# EAGLE design Protoboard MX3-11-8 (EAGLE 7.7.0)

## Sheet 1 of 2
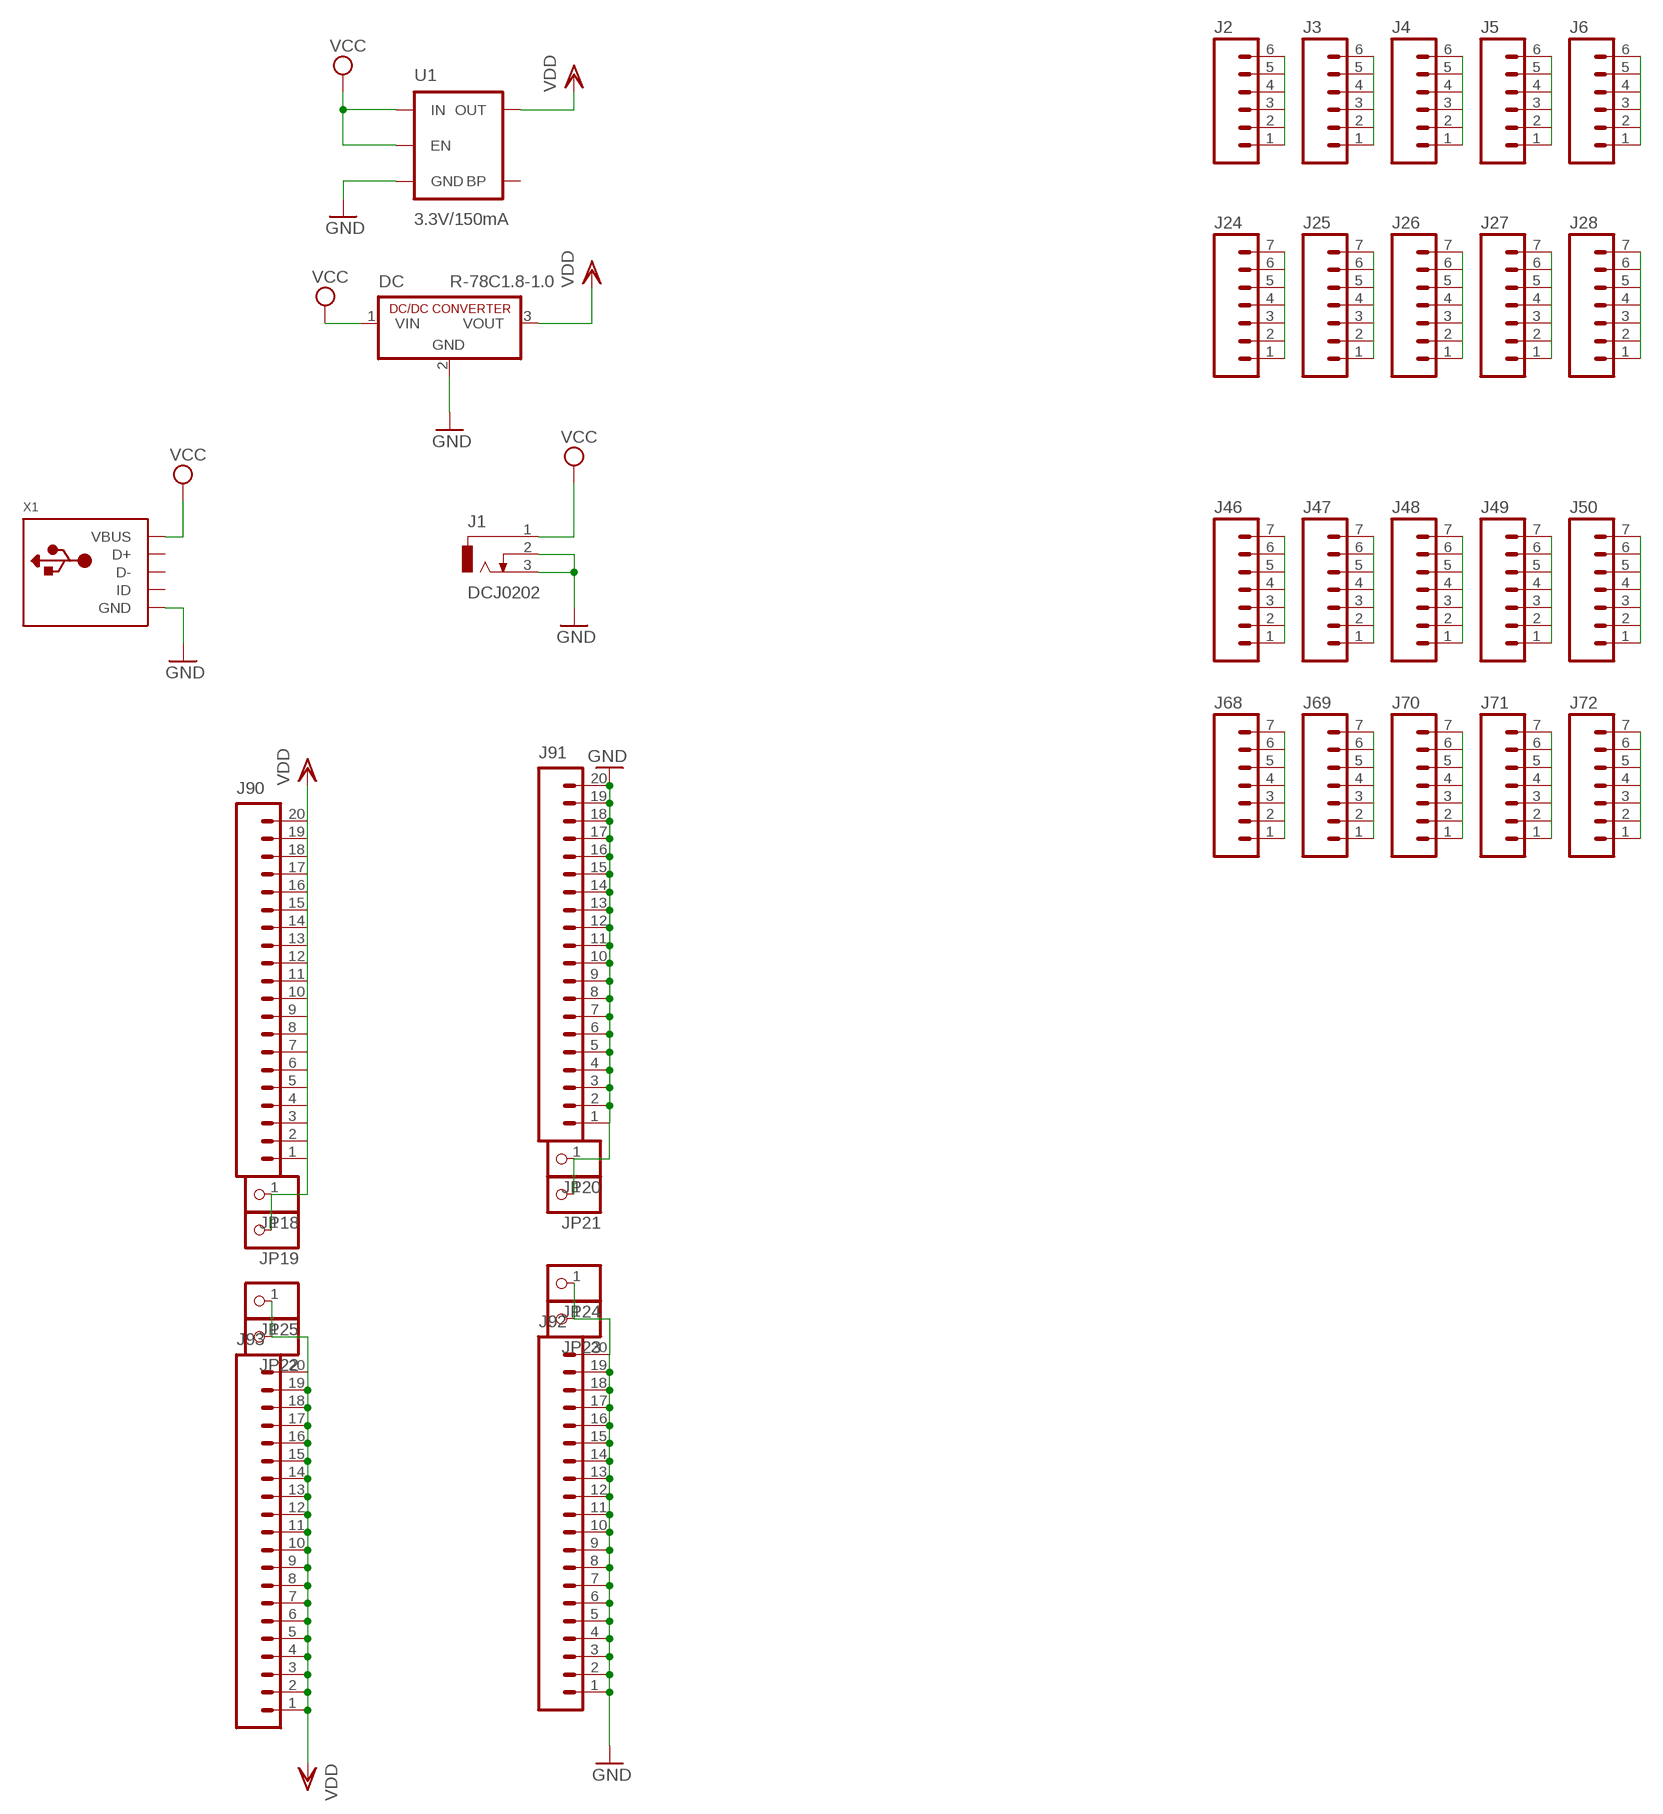
[diagram p0: schematic, sheet 1, part 1 of 2]
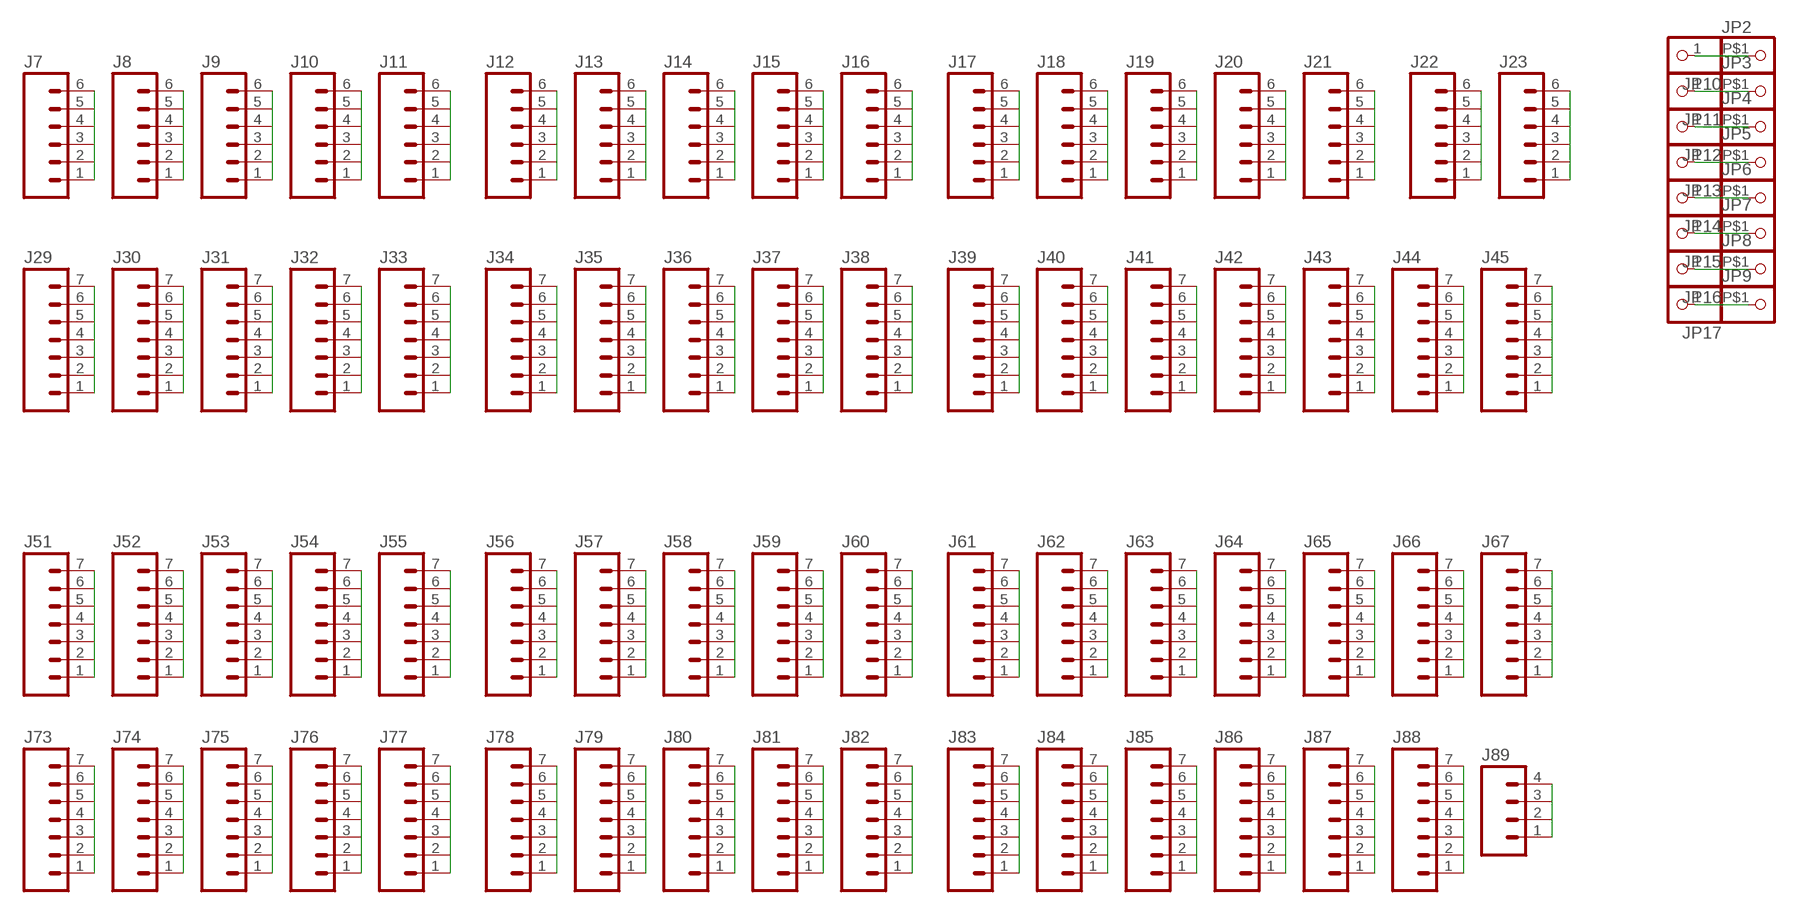
[diagram p1: schematic, sheet 1, part 2 of 2]

### Parts
DC  R-78C1.8-1.0  [SIP3]
J1  DCJ0202  [DCJ0202]
J2  M06NO_SILK_FEMALE_PTH  [1X06_NO_SILK]
J3  M06NO_SILK_FEMALE_PTH  [1X06_NO_SILK]
J4  M06NO_SILK_FEMALE_PTH  [1X06_NO_SILK]
J5  M06NO_SILK_FEMALE_PTH  [1X06_NO_SILK]
J6  M06NO_SILK_FEMALE_PTH  [1X06_NO_SILK]
J7  M06NO_SILK_FEMALE_PTH  [1X06_NO_SILK]
J8  M06NO_SILK_FEMALE_PTH  [1X06_NO_SILK]
J9  M06NO_SILK_FEMALE_PTH  [1X06_NO_SILK]
J10  M06NO_SILK_FEMALE_PTH  [1X06_NO_SILK]
J11  M06NO_SILK_FEMALE_PTH  [1X06_NO_SILK]
J12  M06NO_SILK_FEMALE_PTH  [1X06_NO_SILK]
J13  M06NO_SILK_FEMALE_PTH  [1X06_NO_SILK]
J14  M06NO_SILK_FEMALE_PTH  [1X06_NO_SILK]
J15  M06NO_SILK_FEMALE_PTH  [1X06_NO_SILK]
J16  M06NO_SILK_FEMALE_PTH  [1X06_NO_SILK]
J17  M06NO_SILK_FEMALE_PTH  [1X06_NO_SILK]
J18  M06NO_SILK_FEMALE_PTH  [1X06_NO_SILK]
J19  M06NO_SILK_FEMALE_PTH  [1X06_NO_SILK]
J20  M06NO_SILK_FEMALE_PTH  [1X06_NO_SILK]
J21  M06NO_SILK_FEMALE_PTH  [1X06_NO_SILK]
J22  M06NO_SILK_FEMALE_PTH  [1X06_NO_SILK]
J23  M06NO_SILK_FEMALE_PTH  [1X06_NO_SILK]
J24  M07NO_SILK  [1X07_NO_SILK]
J25  M07NO_SILK  [1X07_NO_SILK]
J26  M07NO_SILK  [1X07_NO_SILK]
J27  M07NO_SILK  [1X07_NO_SILK]
J28  M07NO_SILK  [1X07_NO_SILK]
J29  M07NO_SILK  [1X07_NO_SILK]
J30  M07NO_SILK  [1X07_NO_SILK]
J31  M07NO_SILK  [1X07_NO_SILK]
J32  M07NO_SILK  [1X07_NO_SILK]
J33  M07NO_SILK  [1X07_NO_SILK]
J34  M07NO_SILK  [1X07_NO_SILK]
J35  M07NO_SILK  [1X07_NO_SILK]
J36  M07NO_SILK  [1X07_NO_SILK]
J37  M07NO_SILK  [1X07_NO_SILK]
J38  M07NO_SILK  [1X07_NO_SILK]
J39  M07NO_SILK  [1X07_NO_SILK]
J40  M07NO_SILK  [1X07_NO_SILK]
J41  M07NO_SILK  [1X07_NO_SILK]
J42  M07NO_SILK  [1X07_NO_SILK]
J43  M07NO_SILK  [1X07_NO_SILK]
J44  M07NO_SILK  [1X07_NO_SILK]
J45  M07NO_SILK  [1X07_NO_SILK]
J46  M07NO_SILK  [1X07_NO_SILK]
J47  M07NO_SILK  [1X07_NO_SILK]
J48  M07NO_SILK  [1X07_NO_SILK]
J49  M07NO_SILK  [1X07_NO_SILK]
J50  M07NO_SILK  [1X07_NO_SILK]
J51  M07NO_SILK  [1X07_NO_SILK]
J52  M07NO_SILK  [1X07_NO_SILK]
J53  M07NO_SILK  [1X07_NO_SILK]
J54  M07NO_SILK  [1X07_NO_SILK]
J55  M07NO_SILK  [1X07_NO_SILK]
J56  M07NO_SILK  [1X07_NO_SILK]
J57  M07NO_SILK  [1X07_NO_SILK]
J58  M07NO_SILK  [1X07_NO_SILK]
J59  M07NO_SILK  [1X07_NO_SILK]
J60  M07NO_SILK  [1X07_NO_SILK]
J61  M07NO_SILK  [1X07_NO_SILK]
J62  M07NO_SILK  [1X07_NO_SILK]
J63  M07NO_SILK  [1X07_NO_SILK]
J64  M07NO_SILK  [1X07_NO_SILK]
J65  M07NO_SILK  [1X07_NO_SILK]
J66  M07NO_SILK  [1X07_NO_SILK]
J67  M07NO_SILK  [1X07_NO_SILK]
J68  M07NO_SILK  [1X07_NO_SILK]
J69  M07NO_SILK  [1X07_NO_SILK]
J70  M07NO_SILK  [1X07_NO_SILK]
J71  M07NO_SILK  [1X07_NO_SILK]
J72  M07NO_SILK  [1X07_NO_SILK]
J73  M07NO_SILK  [1X07_NO_SILK]
J74  M07NO_SILK  [1X07_NO_SILK]
J75  M07NO_SILK  [1X07_NO_SILK]
J76  M07NO_SILK  [1X07_NO_SILK]
J77  M07NO_SILK  [1X07_NO_SILK]
J78  M07NO_SILK  [1X07_NO_SILK]
J79  M07NO_SILK  [1X07_NO_SILK]
J80  M07NO_SILK  [1X07_NO_SILK]
J81  M07NO_SILK  [1X07_NO_SILK]
J82  M07NO_SILK  [1X07_NO_SILK]
J83  M07NO_SILK  [1X07_NO_SILK]
J84  M07NO_SILK  [1X07_NO_SILK]
J85  M07NO_SILK  [1X07_NO_SILK]
J86  M07NO_SILK  [1X07_NO_SILK]
J87  M07NO_SILK  [1X07_NO_SILK]
J88  M07NO_SILK  [1X07_NO_SILK]
J89  M04NO_SILK_ALL_ROUND  [1X04_NO_SILK_ALL_ROUND]
J90  M20NO_SILK_KIT  [1X20_NO_SILK_KIT]
J91  M20NO_SILK_KIT  [1X20_NO_SILK_KIT]
J92  M20NO_SILK_KIT  [1X20_NO_SILK_KIT]
J93  M20NO_SILK_KIT  [1X20_NO_SILK_KIT]
JP2  PINHD-1X1-BIGPOGO  [1X1-BIGPOGO]
JP3  PINHD-1X1-BIGPOGO  [1X1-BIGPOGO]
JP4  PINHD-1X1-BIGPOGO  [1X1-BIGPOGO]
JP5  PINHD-1X1-BIGPOGO  [1X1-BIGPOGO]
JP6  PINHD-1X1-BIGPOGO  [1X1-BIGPOGO]
JP7  PINHD-1X1-BIGPOGO  [1X1-BIGPOGO]
JP8  PINHD-1X1-BIGPOGO  [1X1-BIGPOGO]
JP9  PINHD-1X1-BIGPOGO  [1X1-BIGPOGO]
JP10  PINHD-1X1CB  [1X01-CLEANBIG]
JP11  PINHD-1X1CB  [1X01-CLEANBIG]
JP12  PINHD-1X1CB  [1X01-CLEANBIG]
JP13  PINHD-1X1CB  [1X01-CLEANBIG]
JP14  PINHD-1X1CB  [1X01-CLEANBIG]
JP15  PINHD-1X1CB  [1X01-CLEANBIG]
JP16  PINHD-1X1CB  [1X01-CLEANBIG]
JP17  PINHD-1X1CB  [1X01-CLEANBIG]
JP18  PINHD-1X1CB  [1X01-CLEANBIG]
JP19  PINHD-1X1CB  [1X01-CLEANBIG]
JP20  PINHD-1X1CB  [1X01-CLEANBIG]
JP21  PINHD-1X1CB  [1X01-CLEANBIG]
JP22  PINHD-1X1CB  [1X01-CLEANBIG]
JP23  PINHD-1X1CB  [1X01-CLEANBIG]
JP24  PINHD-1X1CB  [1X01-CLEANBIG]
JP25  PINHD-1X1CB  [1X01-CLEANBIG]
U1  3.3V/150mA  V_REG_MIC52053.3V  [SOT23-5]
X1  USBMICRO_20329  [4UCONN_20329]

### Nets
GND: DC.2(GND) J1.2 J1.3 J91.1 J91.2 J91.3 J91.4 J91.5 J91.6 J91.7 J91.8 J91.9 J91.10 J91.11 J91.12 J91.13 J91.14 J91.15 J91.16 J91.17 J91.18 J91.19 J91.20 J92.1 J92.2 J92.3 J92.4 J92.5 J92.6 J92.7 J92.8 J92.9 J92.10 J92.11 J92.12 J92.13 J92.14 J92.15 J92.16 J92.17 J92.18 J92.19 J92.20 JP20.1 JP21.1 JP23.1 JP24.1 U1.2(GND) X1.BASE@1(GND) X1.BASE@2(GND) X1.GND X1.SPRT@1(GND) X1.SPRT@2(GND) X1.SPRT@3(GND) X1.SPRT@4(GND)
N$1: J2.1 J2.2 J2.3 J2.4 J2.5 J2.6
N$2: J3.1 J3.2 J3.3 J3.4 J3.5 J3.6
N$3: J4.1 J4.2 J4.3 J4.4 J4.5 J4.6
N$4: J5.1 J5.2 J5.3 J5.4 J5.5 J5.6
N$5: J6.1 J6.2 J6.3 J6.4 J6.5 J6.6
N$6: J7.1 J7.2 J7.3 J7.4 J7.5 J7.6
N$7: J8.1 J8.2 J8.3 J8.4 J8.5 J8.6
N$8: J9.1 J9.2 J9.3 J9.4 J9.5 J9.6
N$9: J10.1 J10.2 J10.3 J10.4 J10.5 J10.6
N$10: J11.1 J11.2 J11.3 J11.4 J11.5 J11.6
N$11: J12.1 J12.2 J12.3 J12.4 J12.5 J12.6
N$12: J13.1 J13.2 J13.3 J13.4 J13.5 J13.6
N$13: J14.1 J14.2 J14.3 J14.4 J14.5 J14.6
N$14: J15.1 J15.2 J15.3 J15.4 J15.5 J15.6
N$15: J16.1 J16.2 J16.3 J16.4 J16.5 J16.6
N$16: J17.1 J17.2 J17.3 J17.4 J17.5 J17.6
N$17: J18.1 J18.2 J18.3 J18.4 J18.5 J18.6
N$18: J19.1 J19.2 J19.3 J19.4 J19.5 J19.6
N$19: J20.1 J20.2 J20.3 J20.4 J20.5 J20.6
N$20: J21.1 J21.2 J21.3 J21.4 J21.5 J21.6
N$21: J22.1 J22.2 J22.3 J22.4 J22.5 J22.6
N$22: J23.1 J23.2 J23.3 J23.4 J23.5 J23.6
N$23: J24.1 J24.2 J24.3 J24.4 J24.5 J24.6 J24.7
N$24: J25.1 J25.2 J25.3 J25.4 J25.5 J25.6 J25.7
N$25: J26.1 J26.2 J26.3 J26.4 J26.5 J26.6 J26.7
N$26: J27.1 J27.2 J27.3 J27.4 J27.5 J27.6 J27.7
N$27: J28.1 J28.2 J28.3 J28.4 J28.5 J28.6 J28.7
N$28: J29.1 J29.2 J29.3 J29.4 J29.5 J29.6 J29.7
N$29: J30.1 J30.2 J30.3 J30.4 J30.5 J30.6 J30.7
N$30: J31.1 J31.2 J31.3 J31.4 J31.5 J31.6 J31.7
N$31: J32.1 J32.2 J32.3 J32.4 J32.5 J32.6 J32.7
N$32: J33.1 J33.2 J33.3 J33.4 J33.5 J33.6 J33.7
N$33: J34.1 J34.2 J34.3 J34.4 J34.5 J34.6 J34.7
N$34: J35.1 J35.2 J35.3 J35.4 J35.5 J35.6 J35.7
N$35: J36.1 J36.2 J36.3 J36.4 J36.5 J36.6 J36.7
N$36: J37.1 J37.2 J37.3 J37.4 J37.5 J37.6 J37.7
N$37: J38.1 J38.2 J38.3 J38.4 J38.5 J38.6 J38.7
N$38: J39.1 J39.2 J39.3 J39.4 J39.5 J39.6 J39.7
N$39: J40.1 J40.2 J40.3 J40.4 J40.5 J40.6 J40.7
N$40: J41.1 J41.2 J41.3 J41.4 J41.5 J41.6 J41.7
N$41: J42.1 J42.2 J42.3 J42.4 J42.5 J42.6 J42.7
N$42: J43.1 J43.2 J43.3 J43.4 J43.5 J43.6 J43.7
N$43: J44.1 J44.2 J44.3 J44.4 J44.5 J44.6 J44.7
N$44: J45.1 J45.2 J45.3 J45.4 J45.5 J45.6 J45.7
N$45: J46.1 J46.2 J46.3 J46.4 J46.5 J46.6 J46.7
N$46: J47.1 J47.2 J47.3 J47.4 J47.5 J47.6 J47.7
N$47: J48.1 J48.2 J48.3 J48.4 J48.5 J48.6 J48.7
N$48: J49.1 J49.2 J49.3 J49.4 J49.5 J49.6 J49.7
N$49: J50.1 J50.2 J50.3 J50.4 J50.5 J50.6 J50.7
N$50: J51.1 J51.2 J51.3 J51.4 J51.5 J51.6 J51.7
N$51: J52.1 J52.2 J52.3 J52.4 J52.5 J52.6 J52.7
N$52: J53.1 J53.2 J53.3 J53.4 J53.5 J53.6 J53.7
N$53: J54.1 J54.2 J54.3 J54.4 J54.5 J54.6 J54.7
N$54: J55.1 J55.2 J55.3 J55.4 J55.5 J55.6 J55.7
N$55: J56.1 J56.2 J56.3 J56.4 J56.5 J56.6 J56.7
N$56: J57.1 J57.2 J57.3 J57.4 J57.5 J57.6 J57.7
N$57: J58.1 J58.2 J58.3 J58.4 J58.5 J58.6 J58.7
N$58: J59.1 J59.2 J59.3 J59.4 J59.5 J59.6 J59.7
N$59: J60.1 J60.2 J60.3 J60.4 J60.5 J60.6 J60.7
N$60: J61.1 J61.2 J61.3 J61.4 J61.5 J61.6 J61.7
N$61: J62.1 J62.2 J62.3 J62.4 J62.5 J62.6 J62.7
N$62: J63.1 J63.2 J63.3 J63.4 J63.5 J63.6 J63.7
N$63: J64.1 J64.2 J64.3 J64.4 J64.5 J64.6 J64.7
N$64: J65.1 J65.2 J65.3 J65.4 J65.5 J65.6 J65.7
N$65: J66.1 J66.2 J66.3 J66.4 J66.5 J66.6 J66.7
N$66: J67.1 J67.2 J67.3 J67.4 J67.5 J67.6 J67.7
N$67: J68.1 J68.2 J68.3 J68.4 J68.5 J68.6 J68.7
N$68: J69.1 J69.2 J69.3 J69.4 J69.5 J69.6 J69.7
N$69: J70.1 J70.2 J70.3 J70.4 J70.5 J70.6 J70.7
N$70: J71.1 J71.2 J71.3 J71.4 J71.5 J71.6 J71.7
N$71: J72.1 J72.2 J72.3 J72.4 J72.5 J72.6 J72.7
N$72: J73.1 J73.2 J73.3 J73.4 J73.5 J73.6 J73.7
N$73: J74.1 J74.2 J74.3 J74.4 J74.5 J74.6 J74.7
N$74: J75.1 J75.2 J75.3 J75.4 J75.5 J75.6 J75.7
N$75: J76.1 J76.2 J76.3 J76.4 J76.5 J76.6 J76.7
N$76: J77.1 J77.2 J77.3 J77.4 J77.5 J77.6 J77.7
N$77: J78.1 J78.2 J78.3 J78.4 J78.5 J78.6 J78.7
N$78: J79.1 J79.2 J79.3 J79.4 J79.5 J79.6 J79.7
N$79: J80.1 J80.2 J80.3 J80.4 J80.5 J80.6 J80.7
N$80: J81.1 J81.2 J81.3 J81.4 J81.5 J81.6 J81.7
N$81: J82.1 J82.2 J82.3 J82.4 J82.5 J82.6 J82.7
N$82: J83.1 J83.2 J83.3 J83.4 J83.5 J83.6 J83.7
N$83: J84.1 J84.2 J84.3 J84.4 J84.5 J84.6 J84.7
N$84: J85.1 J85.2 J85.3 J85.4 J85.5 J85.6 J85.7
N$85: J86.1 J86.2 J86.3 J86.4 J86.5 J86.6 J86.7
N$86: J87.1 J87.2 J87.3 J87.4 J87.5 J87.6 J87.7
N$87: J88.1 J88.2 J88.3 J88.4 J88.5 J88.6 J88.7
N$88: J89.1 J89.2 J89.3 J89.4
N$89: JP2.P$1 JP10.1
N$90: JP3.P$1 JP11.1
N$91: JP4.P$1 JP12.1
N$92: JP5.P$1 JP13.1
N$93: JP6.P$1 JP14.1
N$94: JP7.P$1 JP15.1
N$95: JP8.P$1 JP16.1
N$96: JP9.P$1 JP17.1
VCC: DC.1(VIN) J1.1 U1.1(IN) U1.3(EN) X1.VBUS
VDD: DC.3(VOUT) J90.1 J90.2 J90.3 J90.4 J90.5 J90.6 J90.7 J90.8 J90.9 J90.10 J90.11 J90.12 J90.13 J90.14 J90.15 J90.16 J90.17 J90.18 J90.19 J90.20 J93.1 J93.2 J93.3 J93.4 J93.5 J93.6 J93.7 J93.8 J93.9 J93.10 J93.11 J93.12 J93.13 J93.14 J93.15 J93.16 J93.17 J93.18 J93.19 J93.20 JP18.1 JP19.1 JP22.1 JP25.1 U1.5(OUT)
Unconnected: U1.4(BP) X1.D+ X1.D- X1.ID

## Sheet 2 of 2

## Library data of the parts
DC = dc-dc-converter:R-78C*-1.0: INNOLINE DC/DC-Converter 1.0 AMP SIP3 Single Output Source: Data sheet <http://www.mikrocontroller.net/attachment/150645/157764-da-01-en-DC_DC_WANDLER_R_78C5_0_1_0.pdf>
J1 = con-jack:DCJ0202: DC POWER JACK Source: DCJ0202.pdf; OC_FARNELL: unknown; OC_NEWARK: unknown
J2-J23 = SparkFun-Connectors:M06: Header 6 Standard 6-pin 0.1" header. Use with straight break away headers (SKU : PRT-00116), right angle break away headers (PRT-00553), swiss pins (PRT-00743), machine pins (PRT-00117), and female headers (PRT-00115). Molex polarized connector foot print use with SKU : PRT-08094 with associated crimp pins and housings. NOTES ON THE VARIANTS LOCK and LOCK_LONGPADS... This footprint was designed to help hold the alignment of a through-hole component (i.e. 6-pin header) while soldering it into place. You may notice that each hole has been shifted either up or down by 0.005 of an inch from it's more standard position (which is a perfectly straight line). This slight alteration caused the pins (the squares in the middle) to touch the edges of the holes. Because they are alternating, it causes a "brace" to hold the component in place. 0.005 has proven to be the perfect amount of "off-center" position when using our standard breakaway headers. Although looks a little odd when you look at the bare footprint, once you have a header in there, the alteration is very hard to notice. Also,if you push a header all the way into place, it is covered up entirely on the bottom side. This idea of altering the position of holes to aid alignment will be further integrated into the Sparkfun Library for other footprints. It can help hold any component with 3 or more connection pins.; PROD_ID: CONN-08437
J24-J88 = SparkFun-Connectors:M07: Header 7 Standard 7-pin 0.1" header. Use with straight break away headers (SKU : PRT-00116), right angle break away headers (PRT-00553), swiss pins (PRT-00743), machine pins (PRT-00117), and female headers (PRT-00115). NOTES ON THE VARIANTS LOCK and LOCK_LONGPADS... This footprint was designed to help hold the alignment of a through-hole component (i.e. 7-pin header) while soldering it into place. You may notice that each hole has been shifted either up or down by 0.005 of an inch from it's more standard position (which is usually a perfectly straight line). This slight alteration caused the pins (the squares in the middle) to touch the edges of the holes. Because they are alternating, it causes a "brace" to hold the header in place. 0.005 has proven to be the perfect amount of "off-center" position when using our standard breakaway headers. Although looks a little odd when you look at the bare footprint, once you have a header in there, the alteration is very hard to notice. Also, if you push a header all the way into place, it is covered up entirely on the bottom side. This idea of altering the position of holes to aid alignment will be further integrated into the Sparkfun Library for other footprints. It can help hold any component with 3 or more connection pins.
J89 = SparkFun-Connectors:M04: Header 4 Standard 4-pin 0.1" header. Use with straight break away headers (SKU : PRT-00116), right angle break away headers (PRT-00553), swiss pins (PRT-00743), machine pins (PRT-00117), and female headers (PRT-00115). Molex polarized connector foot print use with SKU : PRT-08231 with associated crimp pins and housings. 1MM SMD Version SKU: PRT-10208; PROD_ID: CONN-09696
J90-J93 = SparkFun-Connectors:M20: 1x20 .1" header This is just like the LOCK variant in that the holes are staggared by 5 mil, but except for the last two holes. They are not altered from the "standard" footprint layout. This is used for a special purpose on the layout of our Graphic LCD Backpack. Make sure you want to use this device before selecting it for you project!
JP2-JP25 = adafruit:PINHD-1X1: Pin header 1x1 for 0.1" spacing With round pins
U1 = SparkFun-PowerIC:V_REG_MIC5205: V_REG MIC5205 Standard 3.3V, 5V, and Adjustable 150mA LDO voltage regulator in SOT-23 layout. Micrel part MIC5205. BP (by-pass) pin is used to lower output noise with 470pF cap, may be left open. On the adjustable version BP is used to set output.; PROD_ID: VREG-00822
X1 = microbuilder:USB: USB Connectors USBMINIB - Surface Mount Female Mini-B USB Connector 4UConnector: 06564

## Net classes
0 default: width 0.381 mm, drill 0.508 mm, clearance 0.127 mm

## Board
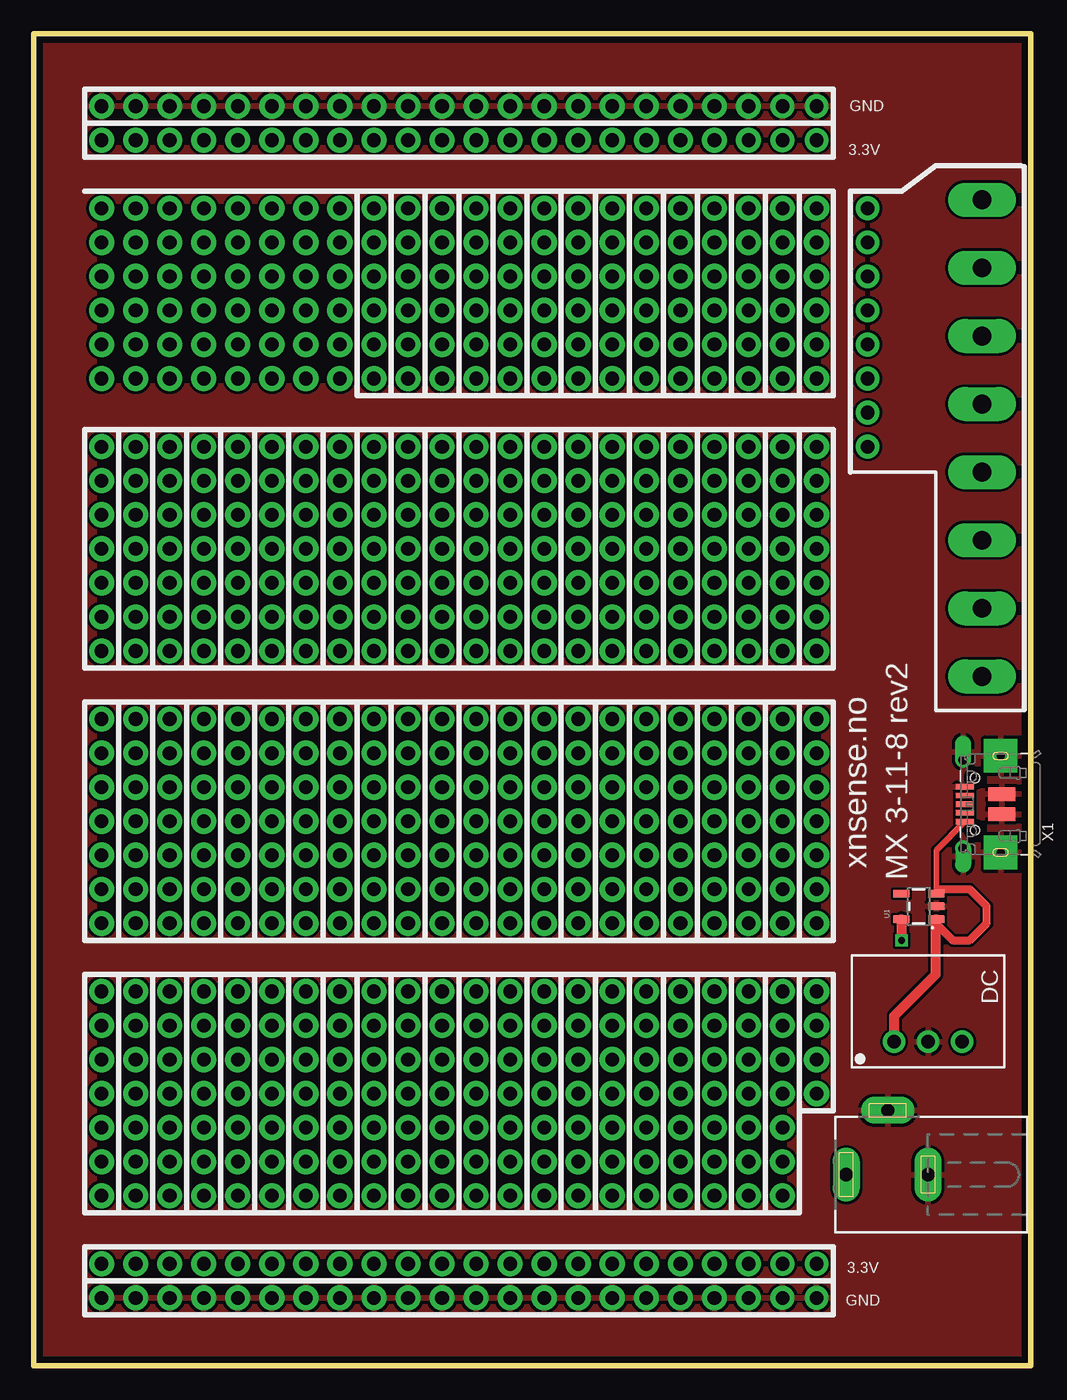
[diagram p2: board, top side]
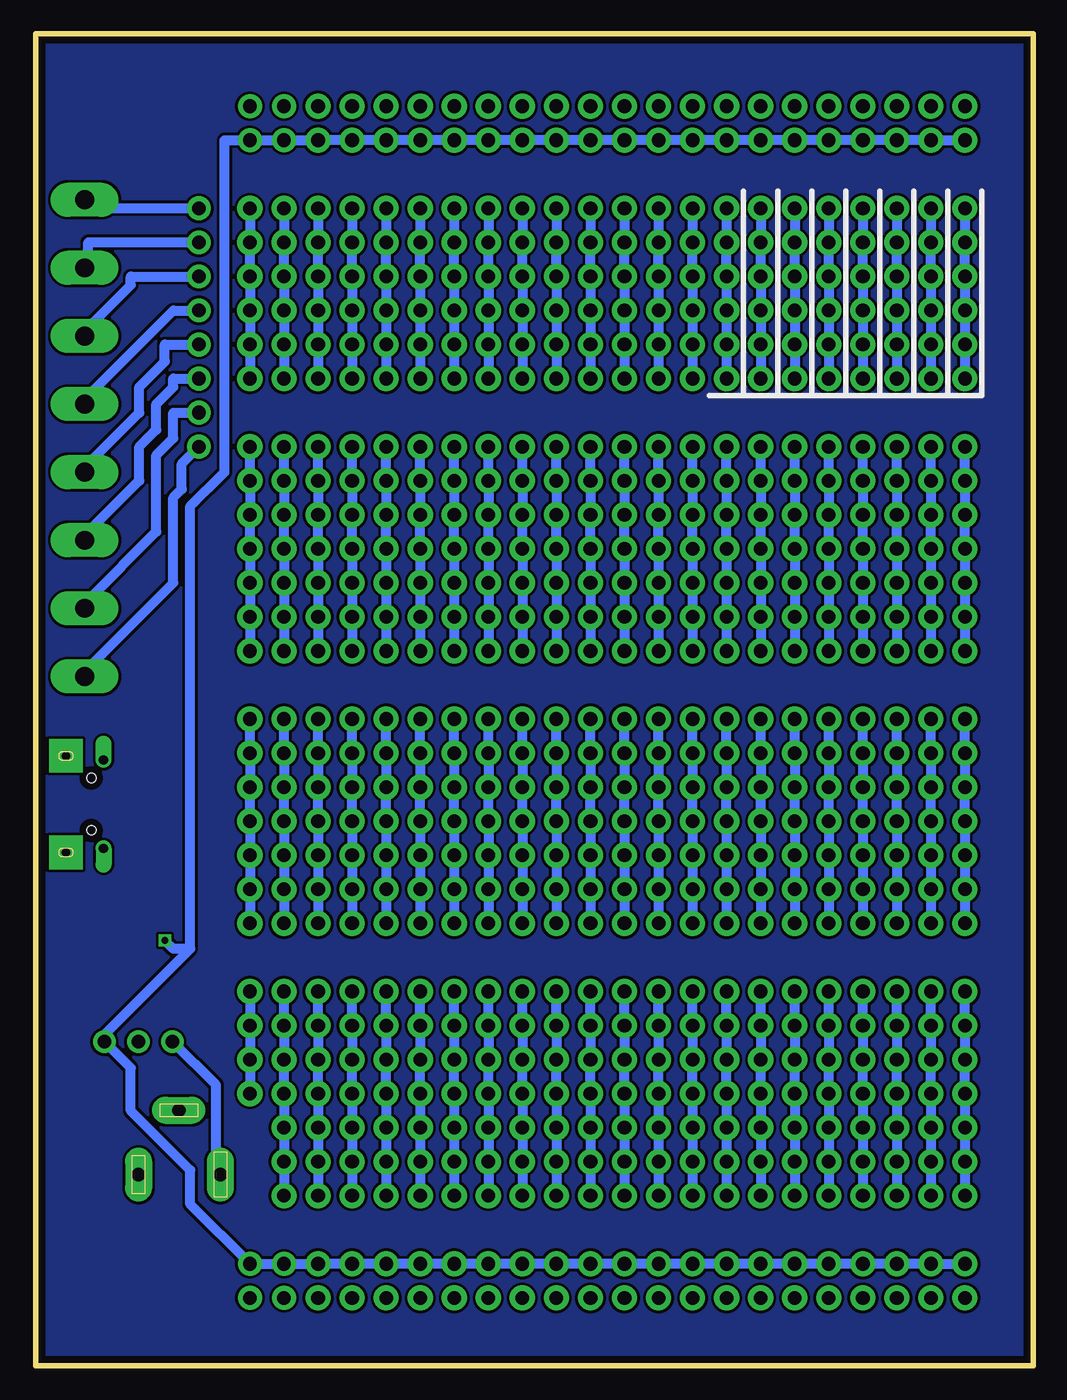
[diagram p3: board, bottom side, seen from below]

Size 74.4 x 99.4 mm. Coordinates in mm from the lower left corner, seen from the top.
Outline: 0,0 0,99.4 74.4,99.4 74.4,0 0,0
Copper layers (1*16): Top 0.035mm / dielectric 1.5mm / Bottom 0.035mm
Design rules "default *": minimum track width 30mil, minimum drill 20mil, track to track 8mil, track to pad 8mil, pad to pad 8mil, via to via 8mil, smd to smd 8mil, copper to edge 20mil, drill to drill 8mil, minimum pad ring 10mil, minimum via ring 8mil, stop-mask expansion 4mil, vias tented up to drill 0mil, thermal gap 10mil

### Footprints (pad centres in the part's own frame; a part is rotated, then mirrored left to right if it is on the bottom)
SIP3 = drill 1 pad 1.676: 1 -2.54,0; 2 0,0; 3 2.54,0
DCJ0202 = drill 1 pad 2 long: 1 0,3.1; 2 4.8,0; 3 0,-3
1X06_NO_SILK = drill 1.016 pad 1.88: 1 0,0; 2 2.54,0; 3 5.08,0; 4 7.62,0; 5 10.16,0; 6 12.7,0
1X07_NO_SILK = drill 1.016 pad 1.88: 1 0,0; 2 2.54,0; 3 5.08,0; 4 7.62,0; 5 10.16,0; 6 12.7,0; 7 15.24,0
1X04_NO_SILK_ALL_ROUND = drill 1.016 pad 1.88: 1 0,0; 2 2.54,0; 3 5.08,0; 4 7.62,0
1X20_NO_SILK_KIT = drill 1.016 pad 1.88: 1 0,0; 2 2.54,0; 3 5.08,0; 4 7.62,0; 5 10.16,0; 6 12.7,0; 7 15.24,0; 8 17.78,0; 9 20.32,0; 10 22.86,0; 11 25.4,0; 12 27.94,0; 13 30.48,0; 14 33.02,0; 15 35.56,0; 16 38.1,0; 17 40.64,0; 18 43.18,0; 19 45.72,0; 20 48.26,0
1X1-BIGPOGO = drill 1.4 pad 2.54 long: P$1 0,0
1X01-CLEANBIG = drill 1.016 pad 1.778: 1 0,0
SOT23-5 = smd 0.55 x 1.2: 1 -0.95,-1.3; 2 0,-1.3; 3 0.95,-1.3; 4 0.95,1.3; 5 -0.95,1.3
4UCONN_20329 = smd 1 x 2: BASE@1 -0.75,-2; BASE@2 0.75,-2 | smd 0.4 x 1.35: D+ 0,0.775; D- -0.65,0.775; GND 1.3,0.775; ID 0.65,0.775; VBUS -1.3,0.775 | drill 0.7 offset: SPRT@1 -3.3,0.9; SPRT@2 3.3,0.9 | drill 0.6 pad 2.5 square: SPRT@3 -3.6,-1.9; SPRT@4 3.6,-1.9 | hole 0.7: -1.95,0; 1.95,0

### Placement (x,y rotation side)
DC  66.75,24.19 0 top
J1  63.73,14.27 90 top
J2  5.08,73.66 90 top
J3  7.62,73.66 90 top
J4  10.16,73.66 90 top
J5  12.7,73.66 90 top
J6  15.24,73.66 90 top
J7  17.78,73.66 90 top
J8  20.32,73.66 90 top
J9  22.86,73.66 90 top
J10  25.4,73.66 90 top
J11  27.94,73.66 90 top
J12  30.48,73.66 90 top
J13  33.02,73.66 90 top
J14  35.56,73.66 90 top
J15  38.1,73.66 90 top
J16  40.64,73.66 90 top
J17  43.18,73.66 90 top
J18  45.72,73.66 90 top
J19  48.26,73.66 90 top
J20  50.8,73.66 90 top
J21  53.34,73.66 90 top
J22  55.88,73.66 90 top
J23  58.42,73.66 90 top
J24  5.08,53.34 90 top
J25  7.62,53.34 90 top
J26  10.16,53.34 90 top
J27  12.7,53.34 90 top
J28  15.24,53.34 90 top
J29  17.78,53.34 90 top
J30  20.32,53.34 90 top
J31  22.86,53.34 90 top
J32  25.4,53.34 90 top
J33  27.94,53.34 90 top
J34  30.48,53.34 90 top
J35  33.02,53.34 90 top
J36  35.56,53.34 90 top
J37  38.1,53.34 90 top
J38  40.64,53.34 90 top
J39  43.18,53.34 90 top
J40  45.72,53.34 90 top
J41  48.26,53.34 90 top
J42  50.8,53.34 90 top
J43  53.34,53.34 90 top
J44  55.88,53.34 90 top
J45  58.42,53.34 90 top
J46  5.08,33.02 90 top
J47  7.62,33.02 90 top
J48  10.16,33.02 90 top
J49  12.7,33.02 90 top
J50  15.24,33.02 90 top
J51  17.78,33.02 90 top
J52  20.32,33.02 90 top
J53  22.86,33.02 90 top
J54  25.4,33.02 90 top
J55  27.94,33.02 90 top
J56  30.48,33.02 90 top
J57  33.02,33.02 90 top
J58  35.56,33.02 90 top
J59  38.1,33.02 90 top
J60  40.64,33.02 90 top
J61  43.18,33.02 90 top
J62  45.72,33.02 90 top
J63  48.26,33.02 90 top
J64  50.8,33.02 90 top
J65  53.34,33.02 90 top
J66  55.88,33.02 90 top
J67  58.42,33.02 90 top
J68  5.08,12.7 90 top
J69  7.62,12.7 90 top
J70  10.16,12.7 90 top
J71  12.7,12.7 90 top
J72  15.24,12.7 90 top
J73  17.78,12.7 90 top
J74  20.32,12.7 90 top
J75  22.86,12.7 90 top
J76  25.4,12.7 90 top
J77  27.94,12.7 90 top
J78  30.48,12.7 90 top
J79  33.02,12.7 90 top
J80  35.56,12.7 90 top
J81  38.1,12.7 90 top
J82  40.64,12.7 90 top
J83  43.18,12.7 90 top
J84  45.72,12.7 90 top
J85  48.26,12.7 90 top
J86  50.8,12.7 90 top
J87  53.34,12.7 90 top
J88  55.88,12.7 90 top
J89  58.42,20.32 90 top
J90  5.08,91.44 0 top
J91  5.08,93.98 0 top
J92  5.08,5.08 0 top
J93  5.08,7.62 0 top
JP2  70.76,87 0 top
JP3  70.76,81.92 0 top
JP4  70.76,76.83 0 top
JP5  70.76,71.75 0 top
JP6  70.76,66.67 0 top
JP7  70.76,61.59 0 top
JP8  70.76,56.52 0 top
JP9  70.76,51.44 0 top
JP10  62.23,86.36 0 top
JP11  62.23,83.82 0 top
JP12  62.23,81.28 0 top
JP13  62.23,78.74 0 top
JP14  62.23,76.2 0 top
JP15  62.23,73.66 0 top
JP16  62.23,71.12 0 top
JP17  62.23,68.58 0 top
JP18  55.88,7.62 0 top
JP19  58.42,7.62 0 top
JP20  55.88,5.08 0 top
JP21  58.42,5.08 0 top
JP22  55.88,91.44 0 top
JP23  55.88,93.98 0 top
JP24  58.42,93.98 0 top
JP25  58.42,91.44 0 top
U1  66.04,34.29 90 top
X1  70.25,41.91 90 top

### Tracks (layer width: path | path; a pad name or v marks a point on that pad's centre or on a via)
GND
  pour Top: 0,99.4 0,0 74.4,0 74.4,99.4
N$1
  Bottom 0.762: J2.6 J2.5 J2.4 J2.3 J2.2 J2.1
N$2
  Bottom 0.762: J3.6 J3.5 J3.4 J3.3 J3.2 J3.1
N$3
  Bottom 0.762: J4.6 J4.5 J4.4 J4.3 J4.2 J4.1
N$4
  Bottom 0.762: J5.6 J5.5 J5.4 J5.3 J5.2 J5.1
N$5
  Bottom 0.762: J6.6 J6.5 J6.4 J6.3 J6.2 J6.1
N$6
  Bottom 0.762: J7.6 J7.5 J7.4 J7.3 J7.2 J7.1
N$7
  Bottom 0.762: J8.6 J8.5 J8.4 J8.3 J8.2 J8.1
N$8
  Bottom 0.762: J9.6 J9.5 J9.4 J9.3 J9.2 J9.1
N$9
  Bottom 0.762: J10.6 J10.5 J10.4 J10.3 J10.2 J10.1
N$10
  Bottom 0.762: J11.6 J11.5 J11.4 J11.3 J11.2 J11.1
N$11
  Bottom 0.762: J12.6 J12.5 J12.4 J12.3 J12.2 J12.1
N$12
  Bottom 0.762: J13.6 J13.5 J13.4 J13.3 J13.2 J13.1
N$13
  Bottom 0.762: J14.6 J14.5 J14.4 J14.3 J14.2 J14.1
N$14
  Bottom 0.762: J15.6 J15.5 J15.4 J15.3 J15.2 J15.1
N$15
  Bottom 0.762: J16.6 J16.5 J16.4 J16.3 J16.2 J16.1
N$16
  Bottom 0.762: J17.6 J17.5 J17.4 J17.3 J17.2 J17.1
N$17
  Bottom 0.762: J18.6 J18.5 J18.4 J18.3 J18.2 J18.1
N$18
  Bottom 0.762: J19.6 J19.5 J19.4 J19.3 J19.2 J19.1
N$19
  Bottom 0.762: J20.6 J20.5 J20.4 J20.3 J20.2 J20.1
N$20
  Bottom 0.762: J21.6 J21.5 J21.4 J21.3 J21.2 J21.1
N$21
  Bottom 0.762: J22.6 J22.5 J22.4 J22.3 J22.2 J22.1
N$22
  Bottom 0.762: J23.6 J23.5 J23.4 J23.3 J23.2 J23.1
N$23
  Bottom 0.762: J24.7 J24.6 J24.5 J24.4 J24.3 J24.2 J24.1
N$24
  Bottom 0.762: J25.7 J25.6 J25.5 J25.4 J25.3 J25.2 J25.1
N$25
  Bottom 0.762: J26.7 J26.6 J26.5 J26.4 J26.3 J26.2 J26.1
N$26
  Bottom 0.762: J27.7 J27.6 J27.5 J27.4 J27.3 J27.2 J27.1
N$27
  Bottom 0.762: J28.7 J28.6 J28.5 J28.4 J28.3 J28.2 J28.1
N$28
  Bottom 0.762: J29.7 J29.6 J29.5 J29.4 J29.3 J29.2 J29.1
N$29
  Bottom 0.762: J30.7 J30.6 J30.5 J30.4 J30.3 J30.2 J30.1
N$30
  Bottom 0.762: J31.7 J31.6 J31.5 J31.4 J31.3 J31.2 J31.1
N$31
  Bottom 0.762: J32.7 J32.6 J32.5 J32.4 J32.3 J32.2 J32.1
N$32
  Bottom 0.762: J33.7 J33.6 J33.5 J33.4 J33.3 J33.2 J33.1
N$33
  Bottom 0.762: J34.7 J34.6 J34.5 J34.4 J34.3 J34.2 J34.1
N$34
  Bottom 0.762: J35.7 J35.6 J35.5 J35.4 J35.3 J35.2 J35.1
N$35
  Bottom 0.762: J36.7 J36.6 J36.5 J36.4 J36.3 J36.2 J36.1
N$36
  Bottom 0.762: J37.7 J37.6 J37.5 J37.4 J37.3 J37.2 J37.1
N$37
  Bottom 0.762: J38.7 J38.6 J38.5 J38.4 J38.3 J38.2 J38.1
N$38
  Bottom 0.762: J39.7 J39.6 J39.5 J39.4 J39.3 J39.2 J39.1
N$39
  Bottom 0.762: J40.7 J40.6 J40.5 J40.4 J40.3 J40.2 J40.1
N$40
  Bottom 0.762: J41.7 J41.6 J41.5 J41.4 J41.3 J41.2 J41.1
N$41
  Bottom 0.762: J42.7 J42.6 J42.5 J42.4 J42.3 J42.2 J42.1
N$42
  Bottom 0.762: J43.7 J43.6 J43.5 J43.4 J43.3 J43.2 J43.1
N$43
  Bottom 0.762: J44.7 J44.6 J44.5 J44.4 J44.3 J44.2 J44.1
N$44
  Bottom 0.762: J45.7 J45.6 J45.5 J45.4 J45.3 J45.2 J45.1
N$45
  Bottom 0.762: J46.7 J46.6 J46.5 J46.4 J46.3 J46.2 J46.1
N$46
  Bottom 0.762: J47.7 J47.6 J47.5 J47.4 J47.3 J47.2 J47.1
N$47
  Bottom 0.762: J48.7 J48.6 J48.5 J48.4 J48.3 J48.2 J48.1
N$48
  Bottom 0.762: J49.7 J49.6 J49.5 J49.4 J49.3 J49.2 J49.1
N$49
  Bottom 0.762: J50.7 J50.6 J50.5 J50.4 J50.3 J50.2 J50.1
N$50
  Bottom 0.762: J51.7 J51.6 J51.5 J51.4 J51.3 J51.2 J51.1
N$51
  Bottom 0.762: J52.7 J52.6 J52.5 J52.4 J52.3 J52.2 J52.1
N$52
  Bottom 0.762: J53.7 J53.6 J53.5 J53.4 J53.3 J53.2 J53.1
N$53
  Bottom 0.762: J54.7 J54.6 J54.5 J54.4 J54.3 J54.2 J54.1
N$54
  Bottom 0.762: J55.7 J55.6 J55.5 J55.4 J55.3 J55.2 J55.1
N$55
  Bottom 0.762: J56.7 J56.6 J56.5 J56.4 J56.3 J56.2 J56.1
N$56
  Bottom 0.762: J57.7 J57.6 J57.5 J57.4 J57.3 J57.2 J57.1
N$57
  Bottom 0.762: J58.7 J58.6 J58.5 J58.4 J58.3 J58.2 J58.1
N$58
  Bottom 0.762: J59.7 J59.6 J59.5 J59.4 J59.3 J59.2 J59.1
N$59
  Bottom 0.762: J60.7 J60.6 J60.5 J60.4 J60.3 J60.2 J60.1
N$60
  Bottom 0.762: J61.7 J61.6 J61.5 J61.4 J61.3 J61.2 J61.1
N$61
  Bottom 0.762: J62.7 J62.6 J62.5 J62.4 J62.3 J62.2 J62.1
N$62
  Bottom 0.762: J63.7 J63.6 J63.5 J63.4 J63.3 J63.2 J63.1
N$63
  Bottom 0.762: J64.7 J64.6 J64.5 J64.4 J64.3 J64.2 J64.1
N$64
  Bottom 0.762: J65.7 J65.6 J65.5 J65.4 J65.3 J65.2 J65.1
N$65
  Bottom 0.762: J66.7 J66.6 J66.5 J66.4 J66.3 J66.2 J66.1
N$66
  Bottom 0.762: J67.7 J67.6 J67.5 J67.4 J67.3 J67.2 J67.1
N$67
  Bottom 0.762: J68.7 J68.6 J68.5 J68.4 J68.3 J68.2 J68.1
N$68
  Bottom 0.762: J69.7 J69.6 J69.5 J69.4 J69.3 J69.2 J69.1
N$69
  Bottom 0.762: J70.7 J70.6 J70.5 J70.4 J70.3 J70.2 J70.1
N$70
  Bottom 0.762: J71.7 J71.6 J71.5 J71.4 J71.3 J71.2 J71.1
N$71
  Bottom 0.762: J72.7 J72.6 J72.5 J72.4 J72.3 J72.2 J72.1
N$72
  Bottom 0.762: J73.7 J73.6 J73.5 J73.4 J73.3 J73.2 J73.1
N$73
  Bottom 0.762: J74.7 J74.6 J74.5 J74.4 J74.3 J74.2 J74.1
N$74
  Bottom 0.762: J75.7 J75.6 J75.5 J75.4 J75.3 J75.2 J75.1
N$75
  Bottom 0.762: J76.7 J76.6 J76.5 J76.4 J76.3 J76.2 J76.1
N$76
  Bottom 0.762: J77.7 J77.6 J77.5 J77.4 J77.3 J77.2 J77.1
N$77
  Bottom 0.762: J78.7 J78.6 J78.5 J78.4 J78.3 J78.2 J78.1
N$78
  Bottom 0.762: J79.7 J79.6 J79.5 J79.4 J79.3 J79.2 J79.1
N$79
  Bottom 0.762: J80.7 J80.6 J80.5 J80.4 J80.3 J80.2 J80.1
N$80
  Bottom 0.762: J81.7 J81.6 J81.5 J81.4 J81.3 J81.2 J81.1
N$81
  Bottom 0.762: J82.7 J82.6 J82.5 J82.4 J82.3 J82.2 J82.1
N$82
  Bottom 0.762: J83.7 J83.6 J83.5 J83.4 J83.3 J83.2 J83.1
N$83
  Bottom 0.762: J84.7 J84.6 J84.5 J84.4 J84.3 J84.2 J84.1
N$84
  Bottom 0.762: J85.7 J85.6 J85.5 J85.4 J85.3 J85.2 J85.1
N$85
  Bottom 0.762: J86.7 J86.6 J86.5 J86.4 J86.3 J86.2 J86.1
N$86
  Bottom 0.762: J87.7 J87.6 J87.5 J87.4 J87.3 J87.2 J87.1
N$87
  Bottom 0.762: J88.7 J88.6 J88.5 J88.4 J88.3 J88.2 J88.1
N$88
  Bottom 0.762: J89.1 J89.2 J89.3 J89.4
N$89
  Bottom 0.762: JP10.1 70.48,86.36 70.48,87 JP2.P$1
N$90
  Bottom 0.762: JP11.1 70.48,83.82 70.48,81.92 JP3.P$1
N$91
  Bottom 0.762: JP12.1 67.31,81.28 67.31,80.64 70.48,77.47 70.48,76.83 JP4.P$1
N$92
  Bottom 0.762: JP13.1 64.14,78.74 70.48,72.39 70.48,71.75 JP5.P$1
N$93
  Bottom 0.762: JP14.1 64.77,76.2 64.77,74.93 66.67,73.03 66.67,71.12 70.48,67.31 70.48,66.67 JP6.P$1
N$94
  Bottom 0.762: JP15.1 64.14,73.66 64.14,73.03 65.41,71.75 65.41,69.85 66.67,68.58 66.67,66.04 70.48,62.23 70.48,61.59 JP7.P$1
N$95
  Bottom 0.762: JP16.1 64.14,71.12 64.14,69.22 65.41,67.94 65.41,62.23 70.48,57.15 70.48,56.52 JP8.P$1
N$96
  Bottom 0.762: JP17.1 63.5,67.31 63.5,65.41 64.14,64.77 64.14,58.42 70.48,52.07 70.48,51.44 JP9.P$1
N$97
  pour Bottom: 0,99.4 74.4,99.4 74.4,0 0,0
VCC
  Top 0.406: U1.3 67.34,38.48 X1.VBUS
  Top 0.61: U1.1 67.34,32.99 68.58,31.75 69.85,31.75 71.12,33.02 71.12,34.29 69.85,35.56 67.66,35.56 U1.3
  Top 0.762: DC.1 64.2,26.11 67.31,29.21 67.31,33.31 U1.1
  Bottom 0.762: DC.1 64.14,24.13 60.96,20.95 60.96,14.61 J1.1
VDD  (via drill 0.51)
  Top 0.762: v64.77,31.75 64.77,33.31 U1.5
  Bottom 0.762: J90.1 J90.2 J90.3 J90.4 J90.5 J90.6 J90.7 J90.8 J90.9 J90.10 J90.11 J90.12 J90.13 J90.14 J90.15 J90.16 J90.17 J90.18 J90.19 J90.20 JP22.1 JP25.1 60.33,91.44 60.33,66.67 62.87,64.14 62.87,31.11 | J93.1 J93.2 J93.3 J93.4 J93.5 J93.6 J93.7 J93.8 J93.9 J93.10 J93.11 J93.12 J93.13 J93.14 J93.15 J93.16 J93.17 J93.18 J93.19 J93.20 JP18.1 JP19.1 62.87,12.06 62.87,14.61 67.31,19.05 67.31,22.23 69.22,24.13 DC.3 69.22,24.77 62.87,31.11 | 62.87,31.11 64.14,31.11 v64.77,31.75

### Text on the board
tNames: GND | 3.3V | MX 3-11-8 rev2 | xnsense.no | 3.3V | GND
Measures: VCC | GND | 3.3V